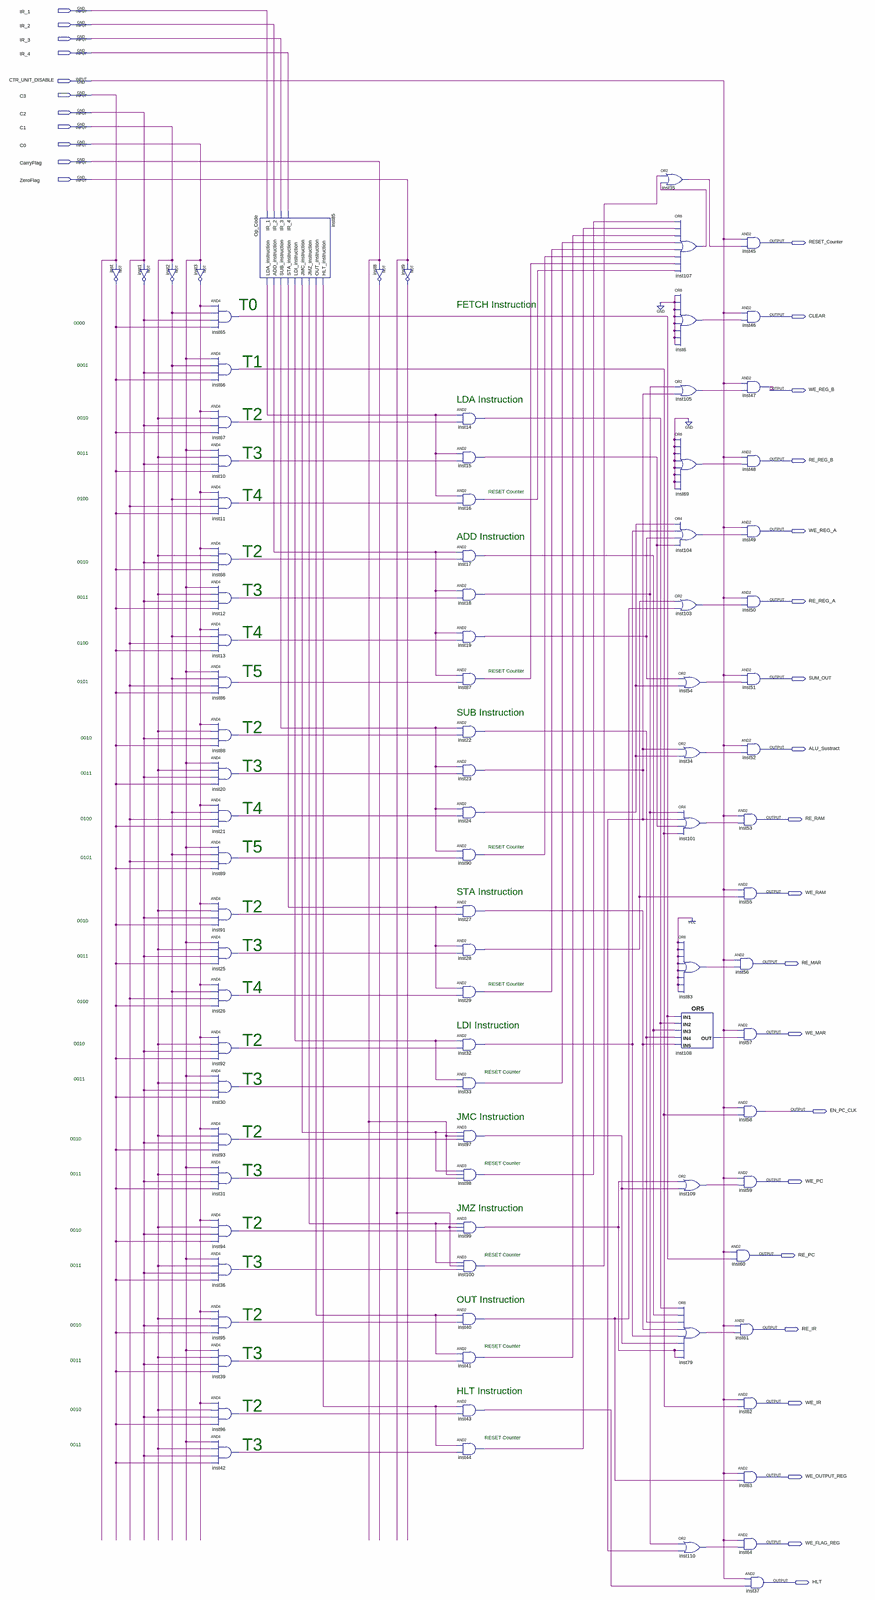
[diagram p0: schematic sheet, whole]
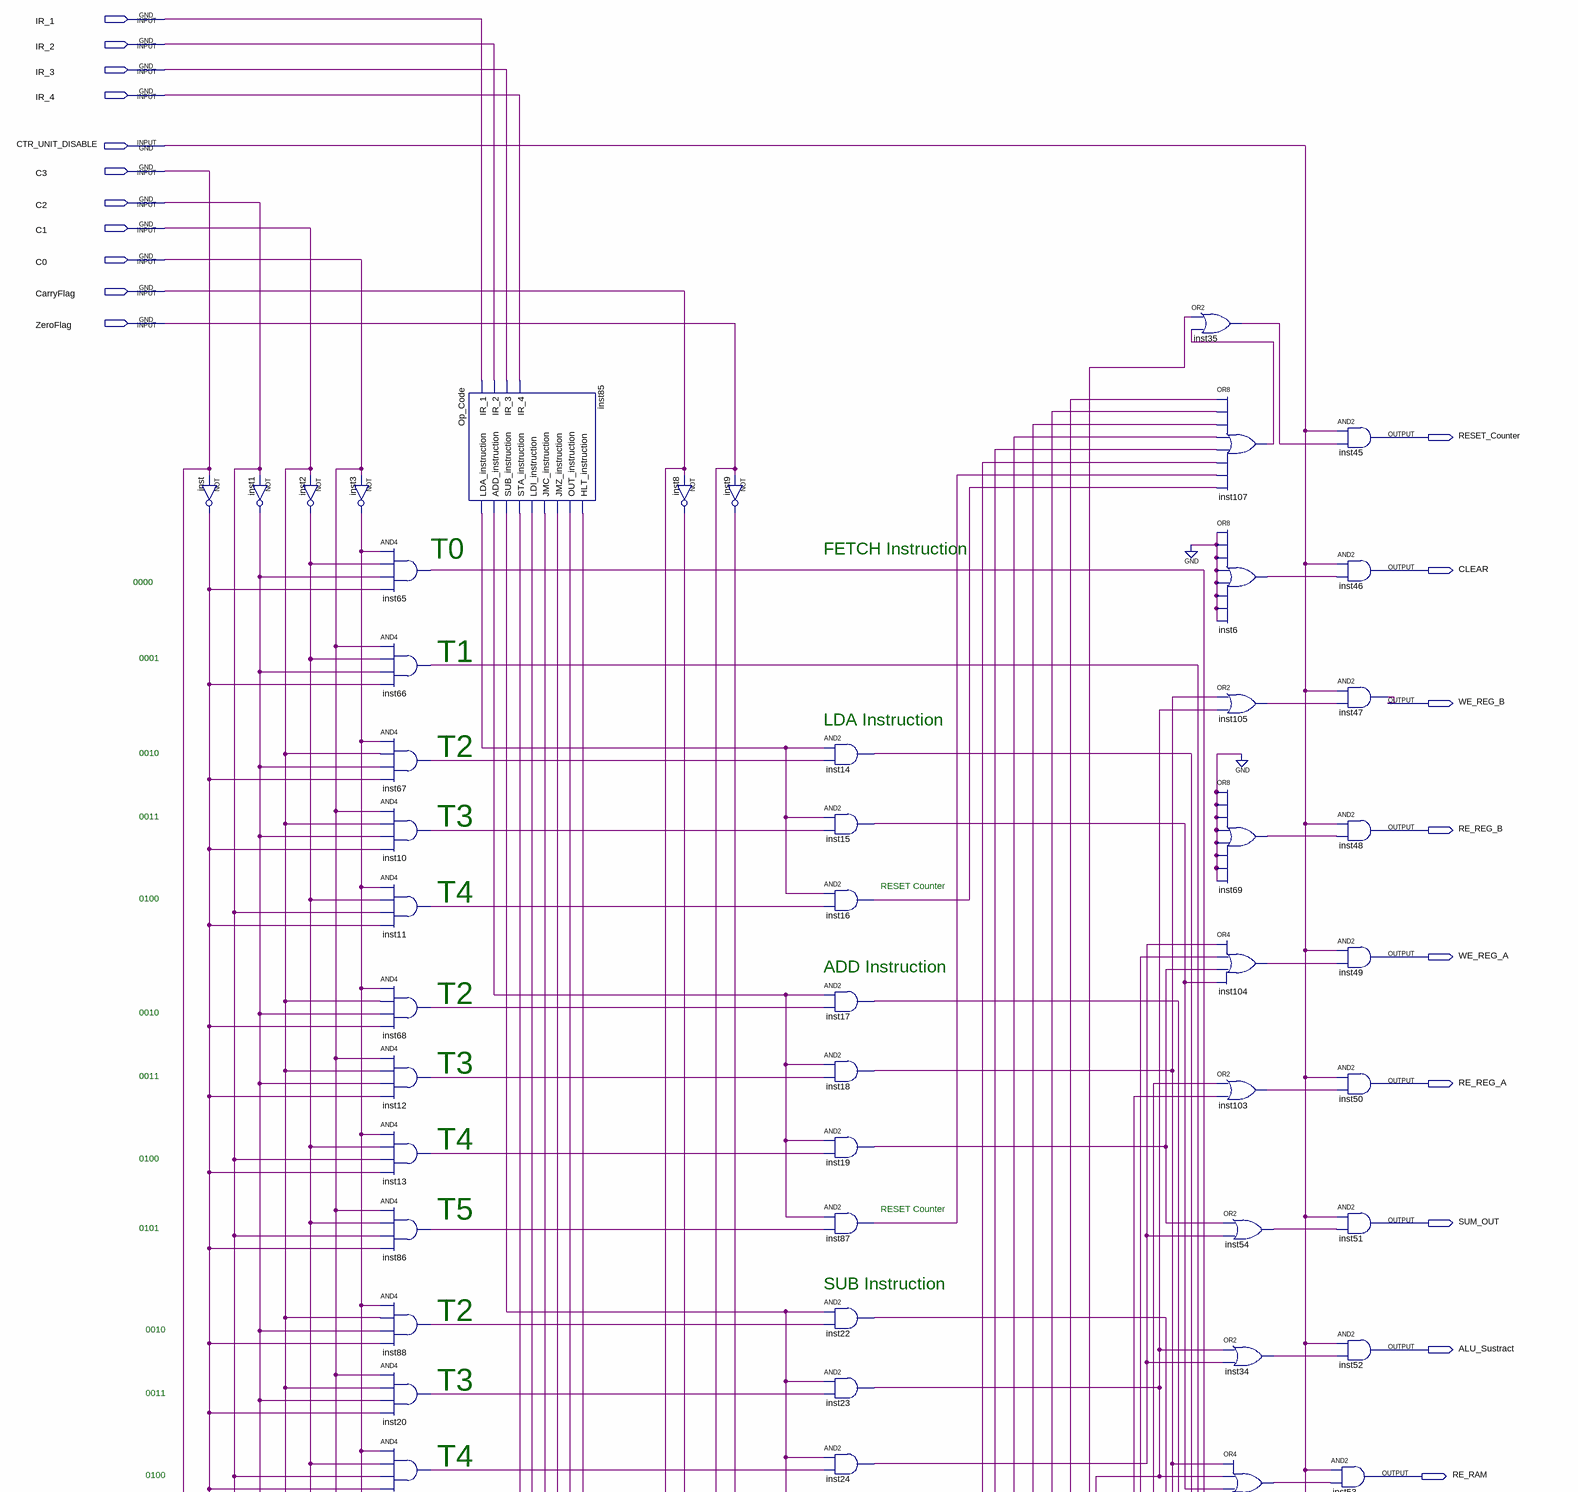
[diagram p1: schematic sheet, upper part]
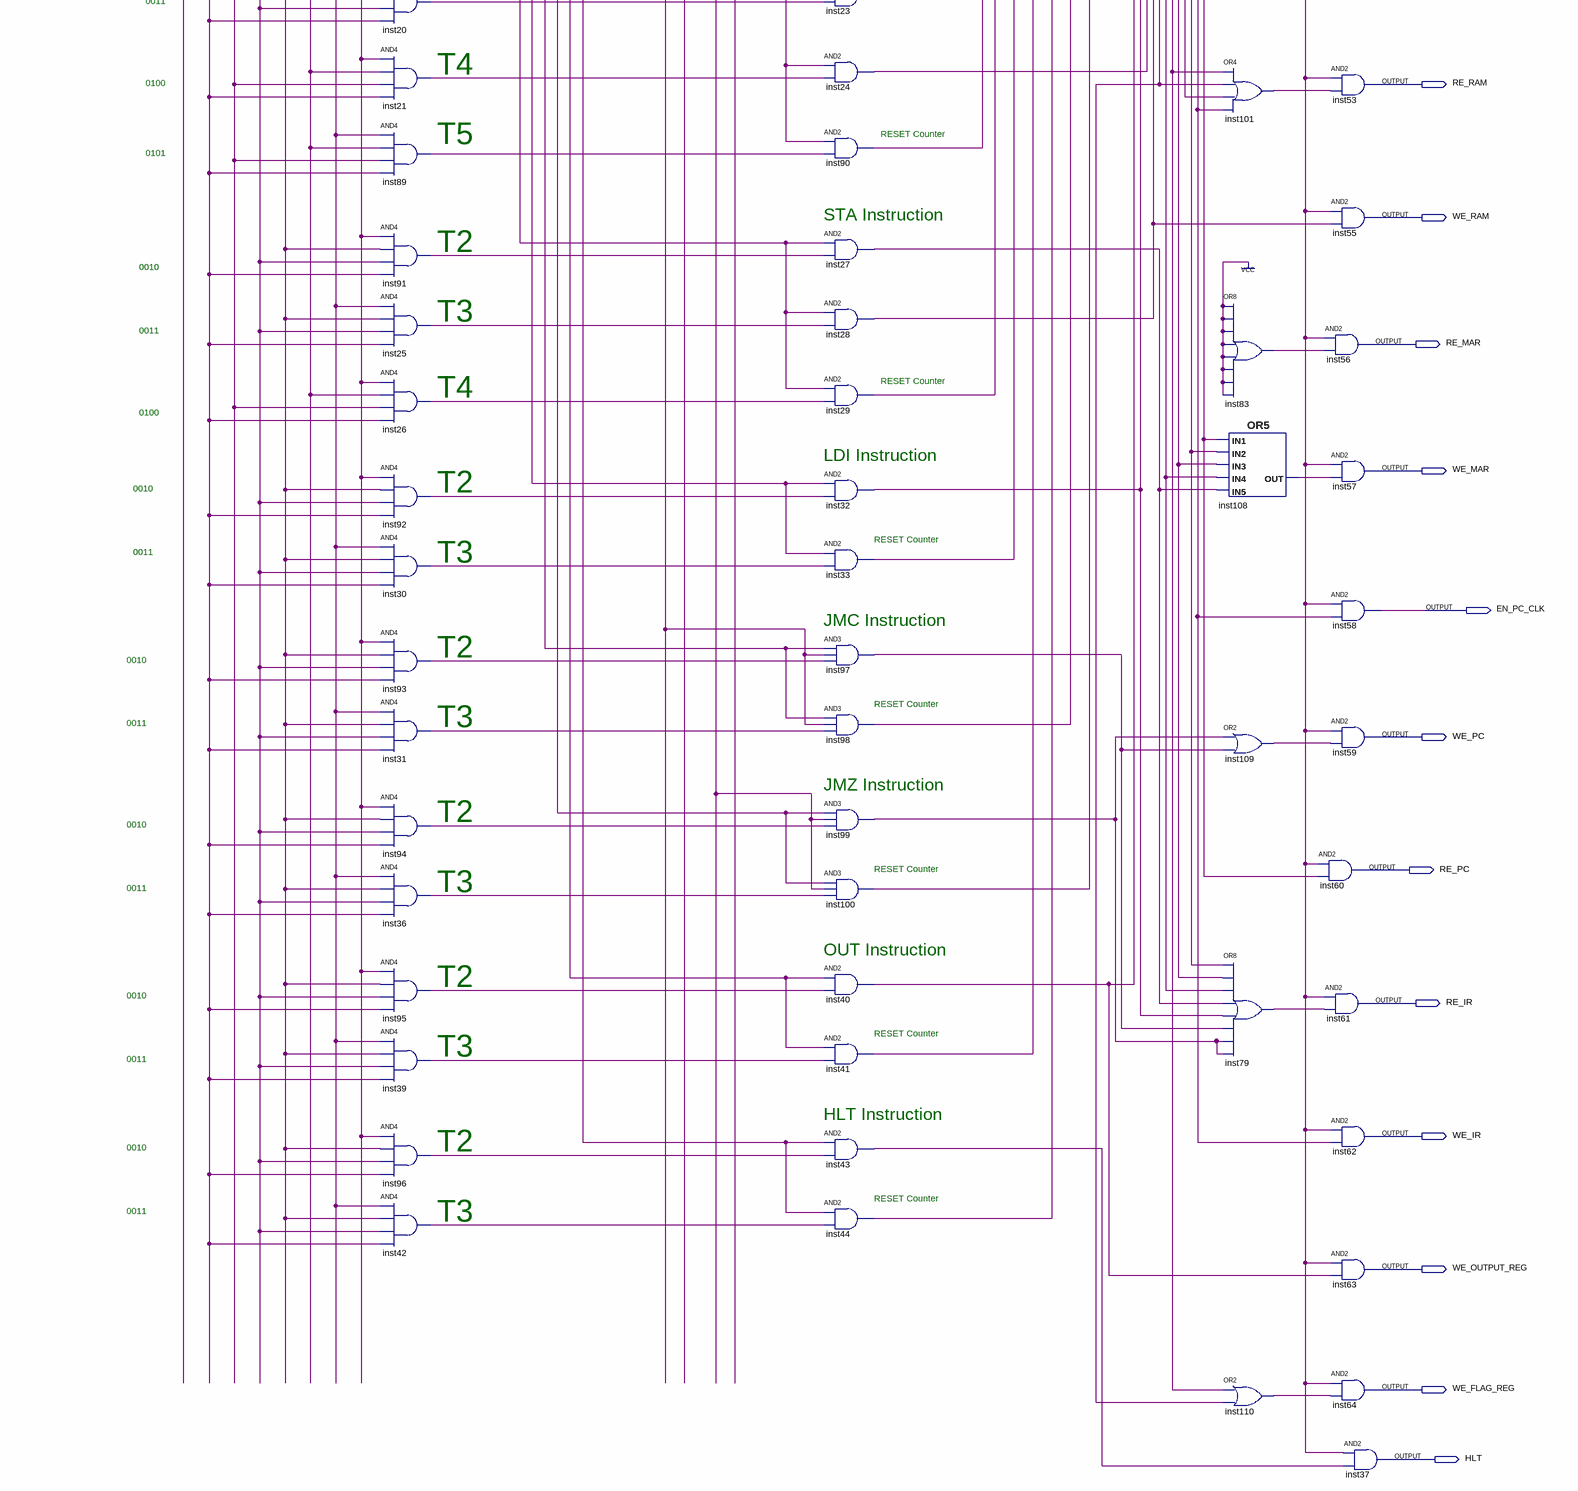
[diagram p2: schematic sheet, lower part]
// Quartus schematic ControlUnit.bdf as structural Verilog: 92 symbols, 31 pins
module ControlUnit (
  input  IR_1,
  input  IR_2,
  input  IR_3,
  input  IR_4,
  input  CTR_UNIT_DISABLE,
  input  C3,
  input  C2,
  input  C1,
  input  C0,
  input  CarryFlag,
  input  ZeroFlag,
  output RESET_Counter,
  output CLEAR,
  output WE_REG_B,
  output RE_REG_B,
  output WE_REG_A,
  output RE_REG_A,
  output SUM_OUT,
  output ALU_Sustract,
  output RE_RAM,
  output WE_RAM,
  output RE_MAR,
  output WE_MAR,
  output EN_PC_CLK,
  output WE_PC,
  output RE_PC,
  output RE_IR,
  output WE_IR,
  output WE_OUTPUT_REG,
  output WE_FLAG_REG,
  output HLT
);

  wire inst1_out, inst2_out, inst3_out, inst6_out, inst8_out, inst9_out, inst10_out, inst11_out, inst12_out,
       inst13_out, inst14_out, inst15_out, inst16_out, inst17_out, inst18_out, inst19_out, inst20_out,
       inst21_out, inst22_out, inst23_out, inst24_out, inst25_out, inst26_out, inst27_out, inst28_out,
       inst29_out, inst30_out, inst31_out, inst32_out, inst33_out, inst34_out, inst35_out, inst36_out,
       inst39_out, inst40_out, inst41_out, inst42_out, inst43_out, inst44_out, inst54_out, inst65_out,
       inst66_out, inst67_out, inst68_out, inst69_out, inst79_out, inst83_out, inst85_add_instruction,
       inst85_hlt_instruction, inst85_jmc_instruction, inst85_jmz_instruction, inst85_lda_instruction,
       inst85_ldi_instruction, inst85_out_instruction, inst85_sta_instruction, inst85_sub_instruction,
       inst86_out, inst87_out, inst88_out, inst89_out, inst90_out, inst91_out, inst92_out, inst93_out,
       inst94_out, inst95_out, inst96_out, inst97_out, inst98_out, inst99_out, inst100_out, inst101_out,
       inst103_out, inst104_out, inst105_out, inst107_out, inst108_out, inst109_out, inst110_out, inst_out;

  not inst (inst_out, C3);
  not inst1 (inst1_out, C2);
  not inst2 (inst2_out, C1);
  not inst3 (inst3_out, C0);
  and inst65 (inst65_out, inst3_out, inst2_out, inst1_out, inst_out);
  and inst66 (inst66_out, C0, inst2_out, inst1_out, inst_out);
  and inst67 (inst67_out, inst3_out, C1, inst1_out, inst_out);
  and inst10 (inst10_out, C0, C1, inst1_out, inst_out);
  and inst11 (inst11_out, inst3_out, inst2_out, C2, inst_out);
  and inst68 (inst68_out, inst3_out, C1, inst1_out, inst_out);
  and inst12 (inst12_out, C0, C1, inst1_out, inst_out);
  and inst13 (inst13_out, inst3_out, inst2_out, C2, inst_out);
  and inst86 (inst86_out, C0, inst2_out, C2, inst_out);
  and inst88 (inst88_out, inst3_out, C1, inst1_out, inst_out);
  and inst20 (inst20_out, C0, C1, inst1_out, inst_out);
  and inst21 (inst21_out, inst3_out, inst2_out, C2, inst_out);
  and inst89 (inst89_out, C0, inst2_out, C2, inst_out);
  and inst91 (inst91_out, inst3_out, C1, inst1_out, inst_out);
  and inst25 (inst25_out, C0, C1, inst1_out, inst_out);
  and inst26 (inst26_out, inst3_out, inst2_out, C2, inst_out);
  and inst92 (inst92_out, inst3_out, C1, inst1_out, inst_out);
  and inst30 (inst30_out, C0, C1, inst1_out, inst_out);
  and inst93 (inst93_out, inst3_out, C1, inst1_out, inst_out);
  and inst31 (inst31_out, C0, C1, inst1_out, inst_out);
  and inst94 (inst94_out, inst3_out, C1, inst1_out, inst_out);
  and inst36 (inst36_out, C0, C1, inst1_out, inst_out);
  and inst95 (inst95_out, inst3_out, C1, inst1_out, inst_out);
  and inst39 (inst39_out, C0, C1, inst1_out, inst_out);
  and inst96 (inst96_out, inst3_out, C1, inst1_out, inst_out);
  and inst42 (inst42_out, C0, C1, inst1_out, inst_out);
  Op_Code inst85 (
    .IR_1(IR_1), .IR_2(IR_2), .IR_3(IR_3), .IR_4(IR_4), .LDA_instruction(inst85_lda_instruction),
    .ADD_instruction(inst85_add_instruction), .SUB_instruction(inst85_sub_instruction),
    .STA_instruction(inst85_sta_instruction), .LDI_instruction(inst85_ldi_instruction),
    .JMC_instruction(inst85_jmc_instruction), .JMZ_instruction(inst85_jmz_instruction),
    .OUT_instruction(inst85_out_instruction), .HLT_instruction(inst85_hlt_instruction));
  not inst8 (inst8_out, CarryFlag);
  not inst9 (inst9_out, ZeroFlag);
  and inst14 (inst14_out, inst85_lda_instruction, inst67_out);
  and inst15 (inst15_out, inst85_lda_instruction, inst10_out);
  and inst16 (inst16_out, inst85_lda_instruction, inst11_out);
  and inst17 (inst17_out, inst85_add_instruction, inst68_out);
  and inst18 (inst18_out, inst85_add_instruction, inst12_out);
  and inst19 (inst19_out, inst85_add_instruction, inst13_out);
  and inst87 (inst87_out, inst85_add_instruction, inst86_out);
  and inst22 (inst22_out, inst85_sub_instruction, inst88_out);
  and inst23 (inst23_out, inst85_sub_instruction, inst20_out);
  and inst24 (inst24_out, inst85_sub_instruction, inst21_out);
  and inst90 (inst90_out, inst85_sub_instruction, inst89_out);
  and inst27 (inst27_out, inst85_sta_instruction, inst91_out);
  and inst28 (inst28_out, inst85_sta_instruction, inst25_out);
  and inst29 (inst29_out, inst85_sta_instruction, inst26_out);
  and inst32 (inst32_out, inst85_ldi_instruction, inst92_out);
  and inst33 (inst33_out, inst85_ldi_instruction, inst30_out);
  and inst97 (inst97_out, inst85_jmc_instruction, CarryFlag, inst93_out);
  and inst98 (inst98_out, inst85_jmc_instruction, CarryFlag, inst31_out);
  and inst99 (inst99_out, inst85_jmz_instruction, ZeroFlag, inst94_out);
  and inst100 (inst100_out, inst85_jmz_instruction, ZeroFlag, inst36_out);
  and inst40 (inst40_out, inst85_out_instruction, inst95_out);
  and inst41 (inst41_out, inst85_out_instruction, inst39_out);
  and inst43 (inst43_out, inst85_hlt_instruction, inst96_out);
  and inst44 (inst44_out, inst85_hlt_instruction, inst42_out);
  or inst35 (inst35_out, inst100_out, inst107_out);
  or inst107 (inst107_out, inst98_out, inst44_out, inst41_out, inst33_out, inst29_out, inst90_out, inst87_out, inst16_out);
  or inst6 (inst6_out, 1'b0, 1'b0, 1'b0, 1'b0, 1'b0, 1'b0, 1'b0, 1'b0);
  or inst105 (inst105_out, inst18_out, inst23_out);
  or inst69 (inst69_out, 1'b0, 1'b0, 1'b0, 1'b0, 1'b0, 1'b0, 1'b0, 1'b0);
  or inst104 (inst104_out, inst24_out, inst32_out, inst19_out, inst15_out);
  or inst103 (inst103_out, inst28_out, inst40_out);
  or inst54 (inst54_out, inst19_out, inst24_out);
  or inst34 (inst34_out, inst23_out, inst24_out);
  or inst101 (inst101_out, inst18_out, inst23_out, inst15_out, inst66_out);
  or inst83 (inst83_out, 1'b1, 1'b1, 1'b1, 1'b1, 1'b1, 1'b1, 1'b1, 1'b1);
  or inst108 (inst108_out, inst65_out, inst14_out, inst17_out, inst22_out, inst27_out);
  or inst109 (inst109_out, inst99_out, inst97_out);
  or inst79 (inst79_out, inst14_out, inst17_out, inst22_out, inst27_out, inst32_out, inst97_out, inst99_out, inst99_out);
  or inst110 (inst110_out, inst18_out, inst23_out);
  and inst45 (RESET_Counter, CTR_UNIT_DISABLE, inst35_out);
  and inst46 (CLEAR, CTR_UNIT_DISABLE, inst6_out);
  and inst47 (WE_REG_B, CTR_UNIT_DISABLE, inst105_out);
  and inst48 (RE_REG_B, CTR_UNIT_DISABLE, inst69_out);
  and inst49 (WE_REG_A, CTR_UNIT_DISABLE, inst104_out);
  and inst50 (RE_REG_A, CTR_UNIT_DISABLE, inst103_out);
  and inst51 (SUM_OUT, CTR_UNIT_DISABLE, inst54_out);
  and inst52 (ALU_Sustract, CTR_UNIT_DISABLE, inst34_out);
  and inst53 (RE_RAM, CTR_UNIT_DISABLE, inst101_out);
  and inst55 (WE_RAM, CTR_UNIT_DISABLE, inst28_out);
  and inst56 (RE_MAR, CTR_UNIT_DISABLE, inst83_out);
  and inst57 (WE_MAR, CTR_UNIT_DISABLE, inst108_out);
  and inst58 (EN_PC_CLK, CTR_UNIT_DISABLE, inst66_out);
  and inst59 (WE_PC, CTR_UNIT_DISABLE, inst109_out);
  and inst60 (RE_PC, CTR_UNIT_DISABLE, inst65_out);
  and inst61 (RE_IR, CTR_UNIT_DISABLE, inst79_out);
  and inst62 (WE_IR, CTR_UNIT_DISABLE, inst66_out);
  and inst63 (WE_OUTPUT_REG, CTR_UNIT_DISABLE, inst40_out);
  and inst64 (WE_FLAG_REG, CTR_UNIT_DISABLE, inst110_out);
  and inst37 (HLT, CTR_UNIT_DISABLE, inst43_out);

  // Notes on the sheet:
  //   T0
  //   FETCH Instruction
  //   0000   
  //   T1
  //   0001   
  //   LDA Instruction
  //   T2
  //   0010   
  //   T3
  //   0011   
  //   T4
  //   RESET Counter
  //   0100    
  //   ADD Instruction
  //   T2
  //   0010   
  //   T3
  //   0011   
  //   T4
  //   0100    
  //   T5
  //   RESET Counter
  //   0101   
  //   SUB Instruction
  //   T2
  //   0010   
  //   T3
  //   0011   
  //   T4
  //   0100    
  //   T5
  //   RESET Counter
  //   0101   
  //   STA Instruction
  //   T2
  //   0010   
  //   T3
  //   0011   
  //   T4
  //   RESET Counter
  //   0100    
  //   LDI Instruction
  //   T2
  //   0010   
  //   T3
  //   RESET Counter
  //   0011   
  //   JMC Instruction
  //   T2
  //   0010   
  //   T3
  //   RESET Counter
  //   0011   
  //   JMZ Instruction
  //   T2
  //   0010   
  //   T3
  //   RESET Counter
  //   0011   
  //   OUT Instruction
  //   T2
  //   0010   
  //   T3
  //   RESET Counter
  //   0011   
  //   HLT Instruction
  //   T2
  //   0010   
  //   T3
  //   RESET Counter
  //   0011   
endmodule
